# EAGLE design Keyboard Connector (EAGLE 9.5.2)
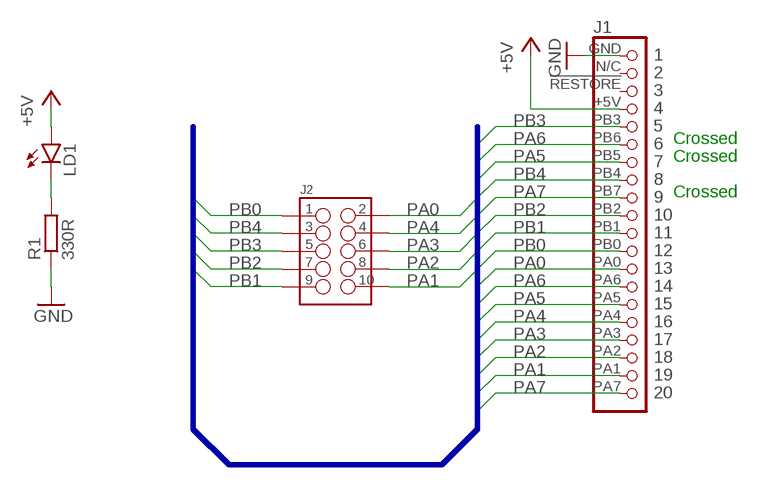
[diagram p0: schematic, sheet 1]

## Parts
J1  C64_KEYBOARD_CONNECTOR  [C64_KEYBOARD_CONNECTOR]
J2  HEADER_2X5-WALLED  [2X5_HEADER_WALLED]
LD1  LED1206  [LED-1206]
R1  330R  R-EU_R0805  [R0805]

## Nets
+5V: J1.+5V LD1.A
GND: J1.GND R1.1
N$1: LD1.C R1.2
PA0: J1.PA0 J2.2
PA1: J1.PA1 J2.10
PA2: J1.PA2 J2.8
PA3: J1.PA3 J2.6
PA4: J1.PA4 J2.4
PA5: J1.PA5 J1.PB5
PA6: J1.PA6 J1.PB6
PA7: J1.PA7 J1.PB7
PB0: J1.PB0 J2.1
PB1: J1.PB1 J2.9
PB2: J1.PB2 J2.7
PB3: J1.PB3 J2.5
PB4: J1.PB4 J2.3
Unconnected: J1.!RESTORE J1.N/C

## Buses
KEYB:PA[0..7],PB[0..7]

## Notes on the sheet
- Crossed
- Crossed
- Crossed

## Library data of the parts
J1 = Per:C64_KEYBOARD_CONNECTOR
J2 = Per:HEADER_2X5
LD1 = SparkFun-LED:LED: LEDs Standard schematic elements and footprints for 5mm, 3mm, 1206, and 0603 sized LEDs. 5mm - Spark Fun Electronics SKU : COM-00529 (and others)
R1 = rcl:R-EU_: RESISTOR, European symbol; SPICEPREFIX: R

## Board
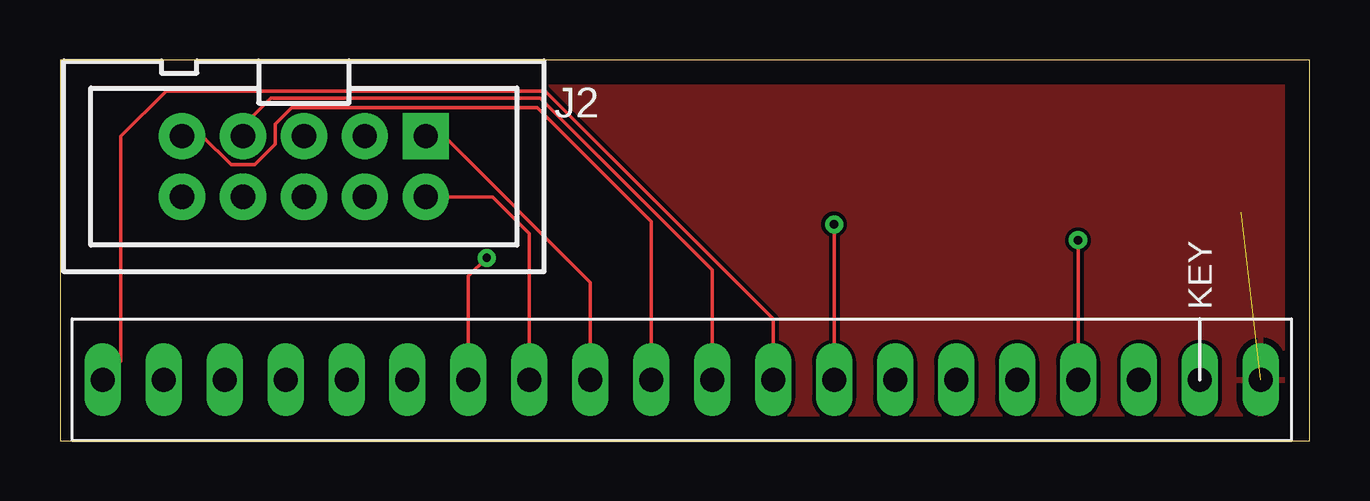
[diagram p1: board, top side]
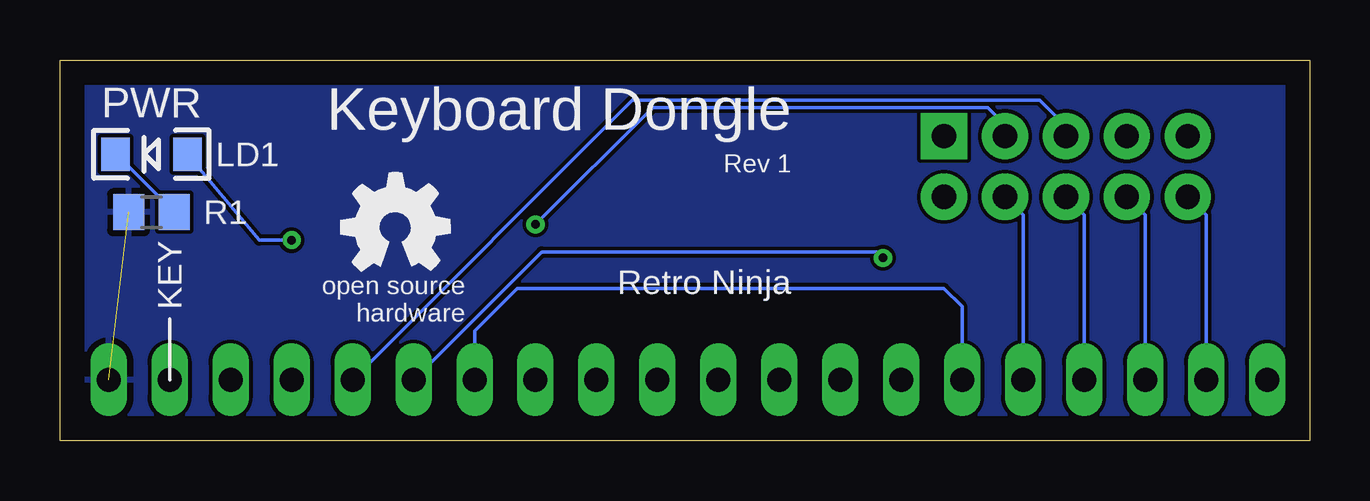
[diagram p2: board, bottom side, seen from below]

Size 52.07 x 15.88 mm. Coordinates in mm from the lower left corner, seen from the top.
Outline: 0,0 52.07,0 52.07,15.88 0,15.88 0,0
Copper layers (1*16): Top 0.035mm / dielectric 0.15mm / Bottom 0.035mm
Design rules "default": minimum track width 6mil, minimum drill 0.35mm, track to track 6mil, track to pad 6mil, pad to pad 6mil, via to via 6mil, smd to smd 6mil, copper to edge 40mil, drill to drill 6mil, minimum pad ring 10mil, minimum via ring 8mil, stop-mask expansion 4mil, vias tented up to drill 0mil, thermal gap 10mil

### Footprints (pad centres in the part's own frame; a part is rotated, then mirrored left to right if it is on the bottom)
C64_KEYBOARD_CONNECTOR = drill 1 pad 1.524 long: !RESTORE 0,19.05; +5V 0,16.51; GND 0,24.13; N/C 0,21.59; PA0 0,-6.35; PA1 0,-21.59; PA2 0,-19.05; PA3 0,-16.51; PA4 0,-13.97; PA5 0,-11.43; PA6 0,-8.89; PA7 0,-24.13; PB0 0,-3.81; PB1 0,-1.27; PB2 0,1.27; PB3 0,13.97; PB4 0,6.35; PB5 0,8.89; PB6 0,11.43; PB7 0,3.81
2X5_HEADER_WALLED = drill 1.016 pad 1.93 square: 1 -5.08,-1.27 | drill 1.016 pad 1.93: 2 -5.08,1.27; 3 -2.54,-1.27; 4 -2.54,1.27; 5 0,-1.27; 6 0,1.27; 7 2.54,-1.27; 8 2.54,1.27; 9 5.08,-1.27; 10 5.08,1.27
LED-1206 = smd 1.2 x 1.4: A -1.5,0; C 1.5,0
R0805 = smd 1.3 x 1.5: 1 -0.95,0; 2 0.95,0

### Placement (x,y rotation side)
J1  25.91,2.54 270 top
J2  10.16,11.43 180 top
LD1  48.26,11.94 180 bottom
R1  48.26,9.53 0 bottom
U$1  [OSHW_5MM]  38.1,8.89 0 bottom

### Tracks (layer width: path | path; a pad name or v marks a point on that pad's centre or on a via)
+5V  (via drill 0.35)
  Top 0.152: v42.42,8.36 J1.+5V
  Bottom 0.152: LD1.A 43.77,8.36 v42.42,8.36
GND  (1 unrouted)
  pour Top: 0,0 0,15.88 52.07,15.88 52.07,0
  pour Bottom: 0,0 0,15.88 52.07,15.88 52.07,0
N$1
  Bottom 0.152: R1.2 49.72,11.94 LD1.C
PA0
  Top 0.152: J2.2 18.03,10.16 19.56,8.64 J1.PA0
PA1
  Bottom 0.152: J1.PA1 4.32,9.4 J2.10
PA2
  Bottom 0.152: J1.PA2 6.86,9.4 J2.8
PA3
  Bottom 0.152: J1.PA3 9.4,9.4 J2.6
PA4
  Bottom 0.152: J1.PA4 11.94,9.4 J2.4
PA5
  Bottom 0.152: J1.PA5 14.48,5.59 15.24,6.35 33.02,6.35 34.8,4.57 J1.PB5
PA6  (via drill 0.35)
  Top 0.152: v17.78,7.62 17.02,6.86 J1.PA6
  Bottom 0.152: J1.PB6 32,7.87 18.03,7.87 v17.78,7.62
PA7
  Top 0.152: J1.PA7 2.54,3.3 2.54,12.7 4.42,14.58 20.22,14.58 29.72,5.08 J1.PB7
PB0
  Top 0.152: J2.1 16,12.7 22.1,6.6 J1.PB0
PB1
  Top 0.152: J2.9 5.93,12.7 7.13,11.51 8.11,11.51 8.97,12.36 8.97,13.19 9.67,13.89 19.89,13.89 24.64,9.14 J1.PB1
PB2
  Top 0.152: J2.7 7.62,13.12 8.78,14.28 20.02,14.28 27.18,7.11 J1.PB2
PB3
  Bottom 0.152: J2.5 10.16,13.12 11.24,14.2 28.22,14.2 J1.PB3
PB4  (via drill 0.35)
  Top 0.152: v32.26,9.02 J1.PB4
  Bottom 0.152: J2.3 12.7,13.18 13.42,13.89 27.38,13.89 v32.26,9.02

### Text on the board
tPlace: KEY
bPlace: Keyboard Dongle | PWR | Rev 1 | Retro Ninja | KEY